# Altium schematic sheet audio_pa.SchDoc: mcHF Pro Transceiver UI board
size A3; Author: Krassi Atanassov; CompanyName: MØNKA; Engineer: For radio amateurs experimentation, non-commercial use only. Thank you!; Revision: 0.8.2; SheetTotal: 18
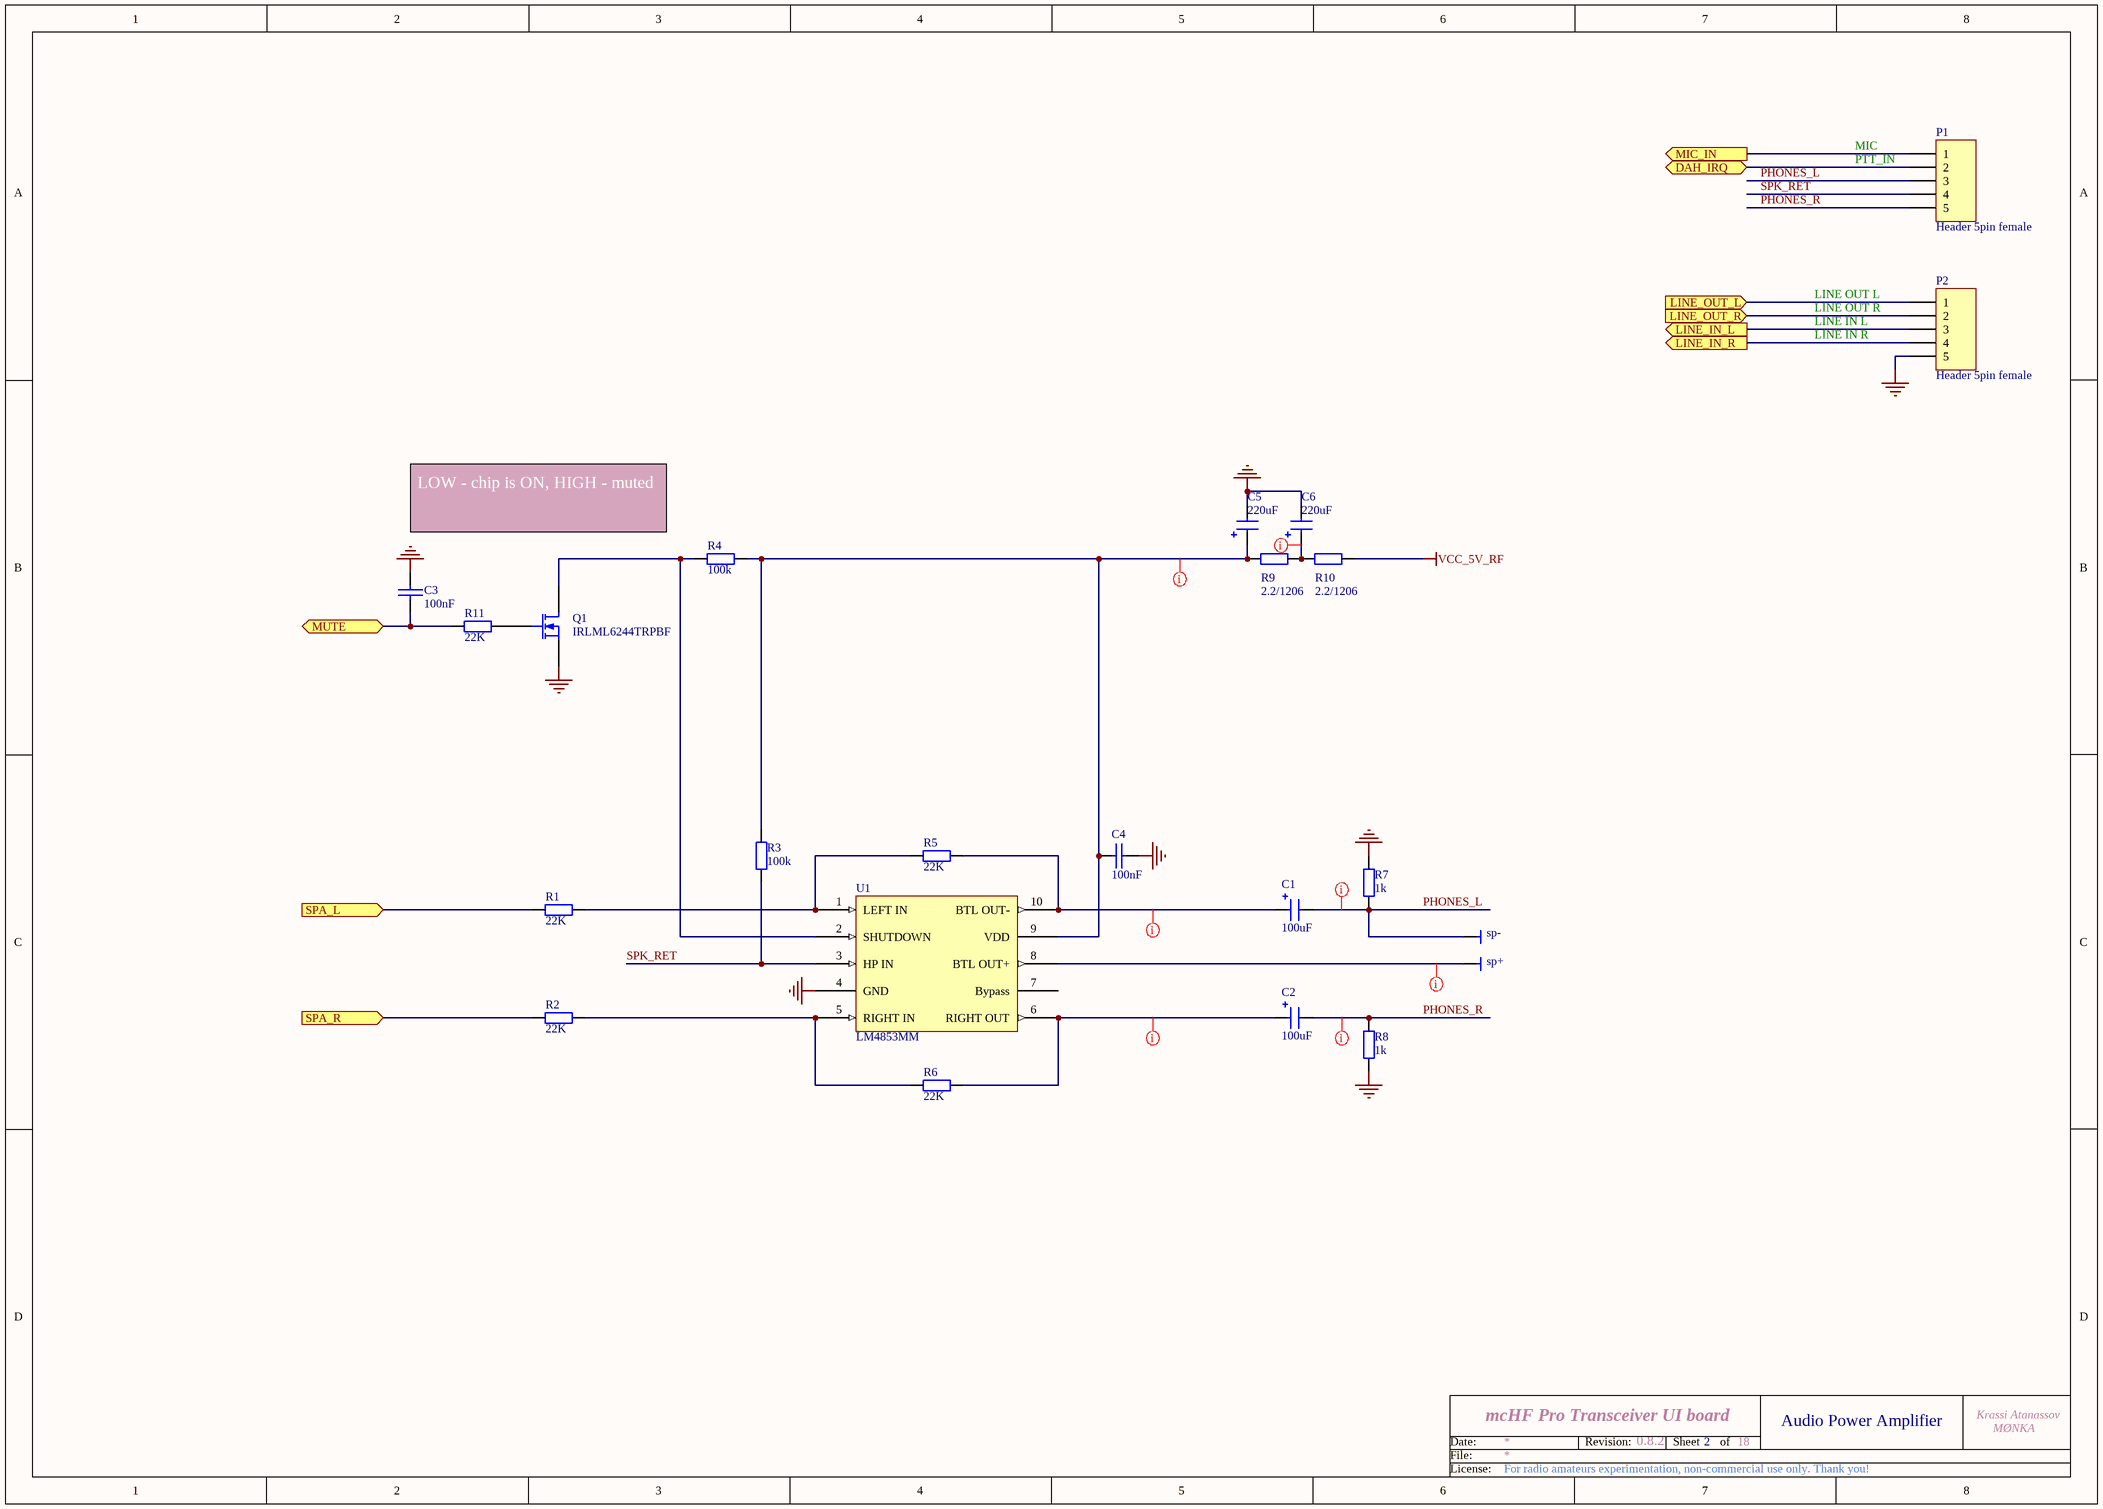
[diagram p0: audio_pa.SchDoc]

## Parts
C1  100uF  [CAP_ALUM_Pro]
C2  100uF  [CAP_ALUM_Pro]
C3  100nF  [0805]
C4  100nF  [0805]
C5  220uF  [CAP_ALUM_Pro]
C6  220uF  [CAP_ALUM_Pro]
P1  Header 5pin female  [HDR1X5]
P2  Header 5pin female  [HDR1X5]
Q1  IRLML6244TRPBF  [SOT-23]
R1  22K  [0805]
R2  22K  [0805]
R3  100k  [0805]
R4  100k  [0805]
R5  22K  [0805]
R6  22K  [0805]
R7  1k  [0805]
R8  1k  [0805]
R9  2.2/1206  [1206]
R10  2.2/1206  [1206]
R11  22K  [0805]
sp+  TP  [tp_big]  (value not drawn)  (no BOM)
sp-  TP  [tp_big]  (value not drawn)  (no BOM)
U1  LM4853MM  [SLAB-MSOP-10_N]

## Ports
DAH_IRQ (bidir), LINE_IN_L (out), LINE_IN_R (out), LINE_OUT_L (in), LINE_OUT_R (in), MIC_IN (out), MUTE (bidir), SPA_L (in), SPA_R (in)

## Nets
GND: C3.1 C4.1 C5.2 C6.2 P2.5 Q1.2(S) R7.2 R8.1 U1.4(GND)
VCC_5V_RF: R10.1
DAH_IRQ: P1.2 ; port DAH_IRQ
LINE_IN_L: P2.3 ; port LINE_IN_L
LINE_IN_R: P2.4 ; port LINE_IN_R
LINE_OUT_L: P2.1 ; port LINE_OUT_L
LINE_OUT_R: P2.2 ; port LINE_OUT_R
MIC_IN: P1.1 ; port MIC_IN
MUTE: C3.2 R11.2 ; port MUTE
PHONES_L: C1.2 P1.3 R7.1 sp-.1
PHONES_R: C2.2 P1.5 R8.2
SPA_L: R1.2 ; port SPA_L
SPA_R: R2.2 ; port SPA_R
SPK_RET: P1.4 R3.2 U1.3(HP_IN)
NetC1_1: C1.1 R5.1 U1.10(BTL_OUT-)
NetC2_1: C2.1 R6.1 U1.6(RIGHT_OUT)
NetC4_2: C4.2 C5.1 R3.1 R4.1 R9.2 U1.9(VDD)
NetC6_1: C6.1 R9.1 R10.2
NetQ1_1: Q1.1(G) R11.1
NetQ1_3: Q1.3(D) R4.2 U1.2(SHUTDOWN)
NetR1_1: R1.1 R5.2 U1.1(LEFT_IN)
NetR2_1: R2.1 R6.2 U1.5(RIGHT_IN)
Netsp+_1: sp+.1 U1.8(BTL_OUT+)

Not connected (* = marked no-connect by the designer): U1 7(Bypass)

## Layout directives
rule Width Constraint [Pref Width = 12mil    Min Width = 12mil    Max Width = 12mil]: NetC1_1, NetC2_1, NetC4_2, NetC6_1, Netsp+_1
rule Width Constraint [Pref Width = 10mil    Min Width = 10mil    Max Width = 10mil]: PHONES_L, PHONES_R

## Notes on the sheet
- MIC
- (near P1) PTT_IN
- LINE OUT L
- LINE OUT R
- LINE IN L
- LINE IN R
- LOW - chip is ON, HIGH - muted
- 2
- Audio Power Amplifier
- Date:
- File:
- Revision:
- Sheet
- of
- License:

## Library data of the parts
C1 = CAP-POL: Electrolitic capacitor; Order: FN 225-4321; QT Order: QCC-00320; Notes: Aluminium capacitor; Price: 0.34
C2 C6 = CAP-POL: Electrolitic capacitor; Order: FN 225-4321; QT Order: QCC-00320; Price: 0.34
C3 C4 = CAP: Capacitor; Order: FN 252-2090; QT Order: QCC-00154; Price: 0.068
C5 = CAP-POL: Electrolitic capacitor; Notes: Aluminium capacitor; Price: 0.34
P1 P2 = Header 5: Header, 5-Pin
Q1 = MOSFET-N: N-Channel MOSFET; QT Order: QCT-00022; QT Price: 0.28; Order: FN 186-4517; Price: 0.231
R1 R2 R5 R6 R11 = RES: Resistor; Order: FN 188-7289; QT Order: QCR-00333; Price: 0.046
R3 R4 = RES: Resistor; Order: FN 157-6459; QT Order: QCR-00579; Price: 0.061
R7 R8 = RES: Resistor; Order: FN 933-2421; QT Order: QCR-00279; Price: 0.013
R9 R10 = RES: Resistor; Order: FN 207-8984; QT Order: QCR-00412; Price: 0.02
sp+ sp- = TP: Test point
U1 = LM4853: Mono 1.5 W / Stereo 300mW Power Amplifier; Notes: 300mW 1ch Mono, 2ch Stereo Audio Amp